# EasyEDA schematic 3 Antenna Mini-Whip (SMD)_ Main module.json
TITLE: Antenna Mini-Whip (SMD): Main module; REV: 1.3.EE; Date: 2018-03-02; Sheet: 1/1; Drawn By: IgrikXD
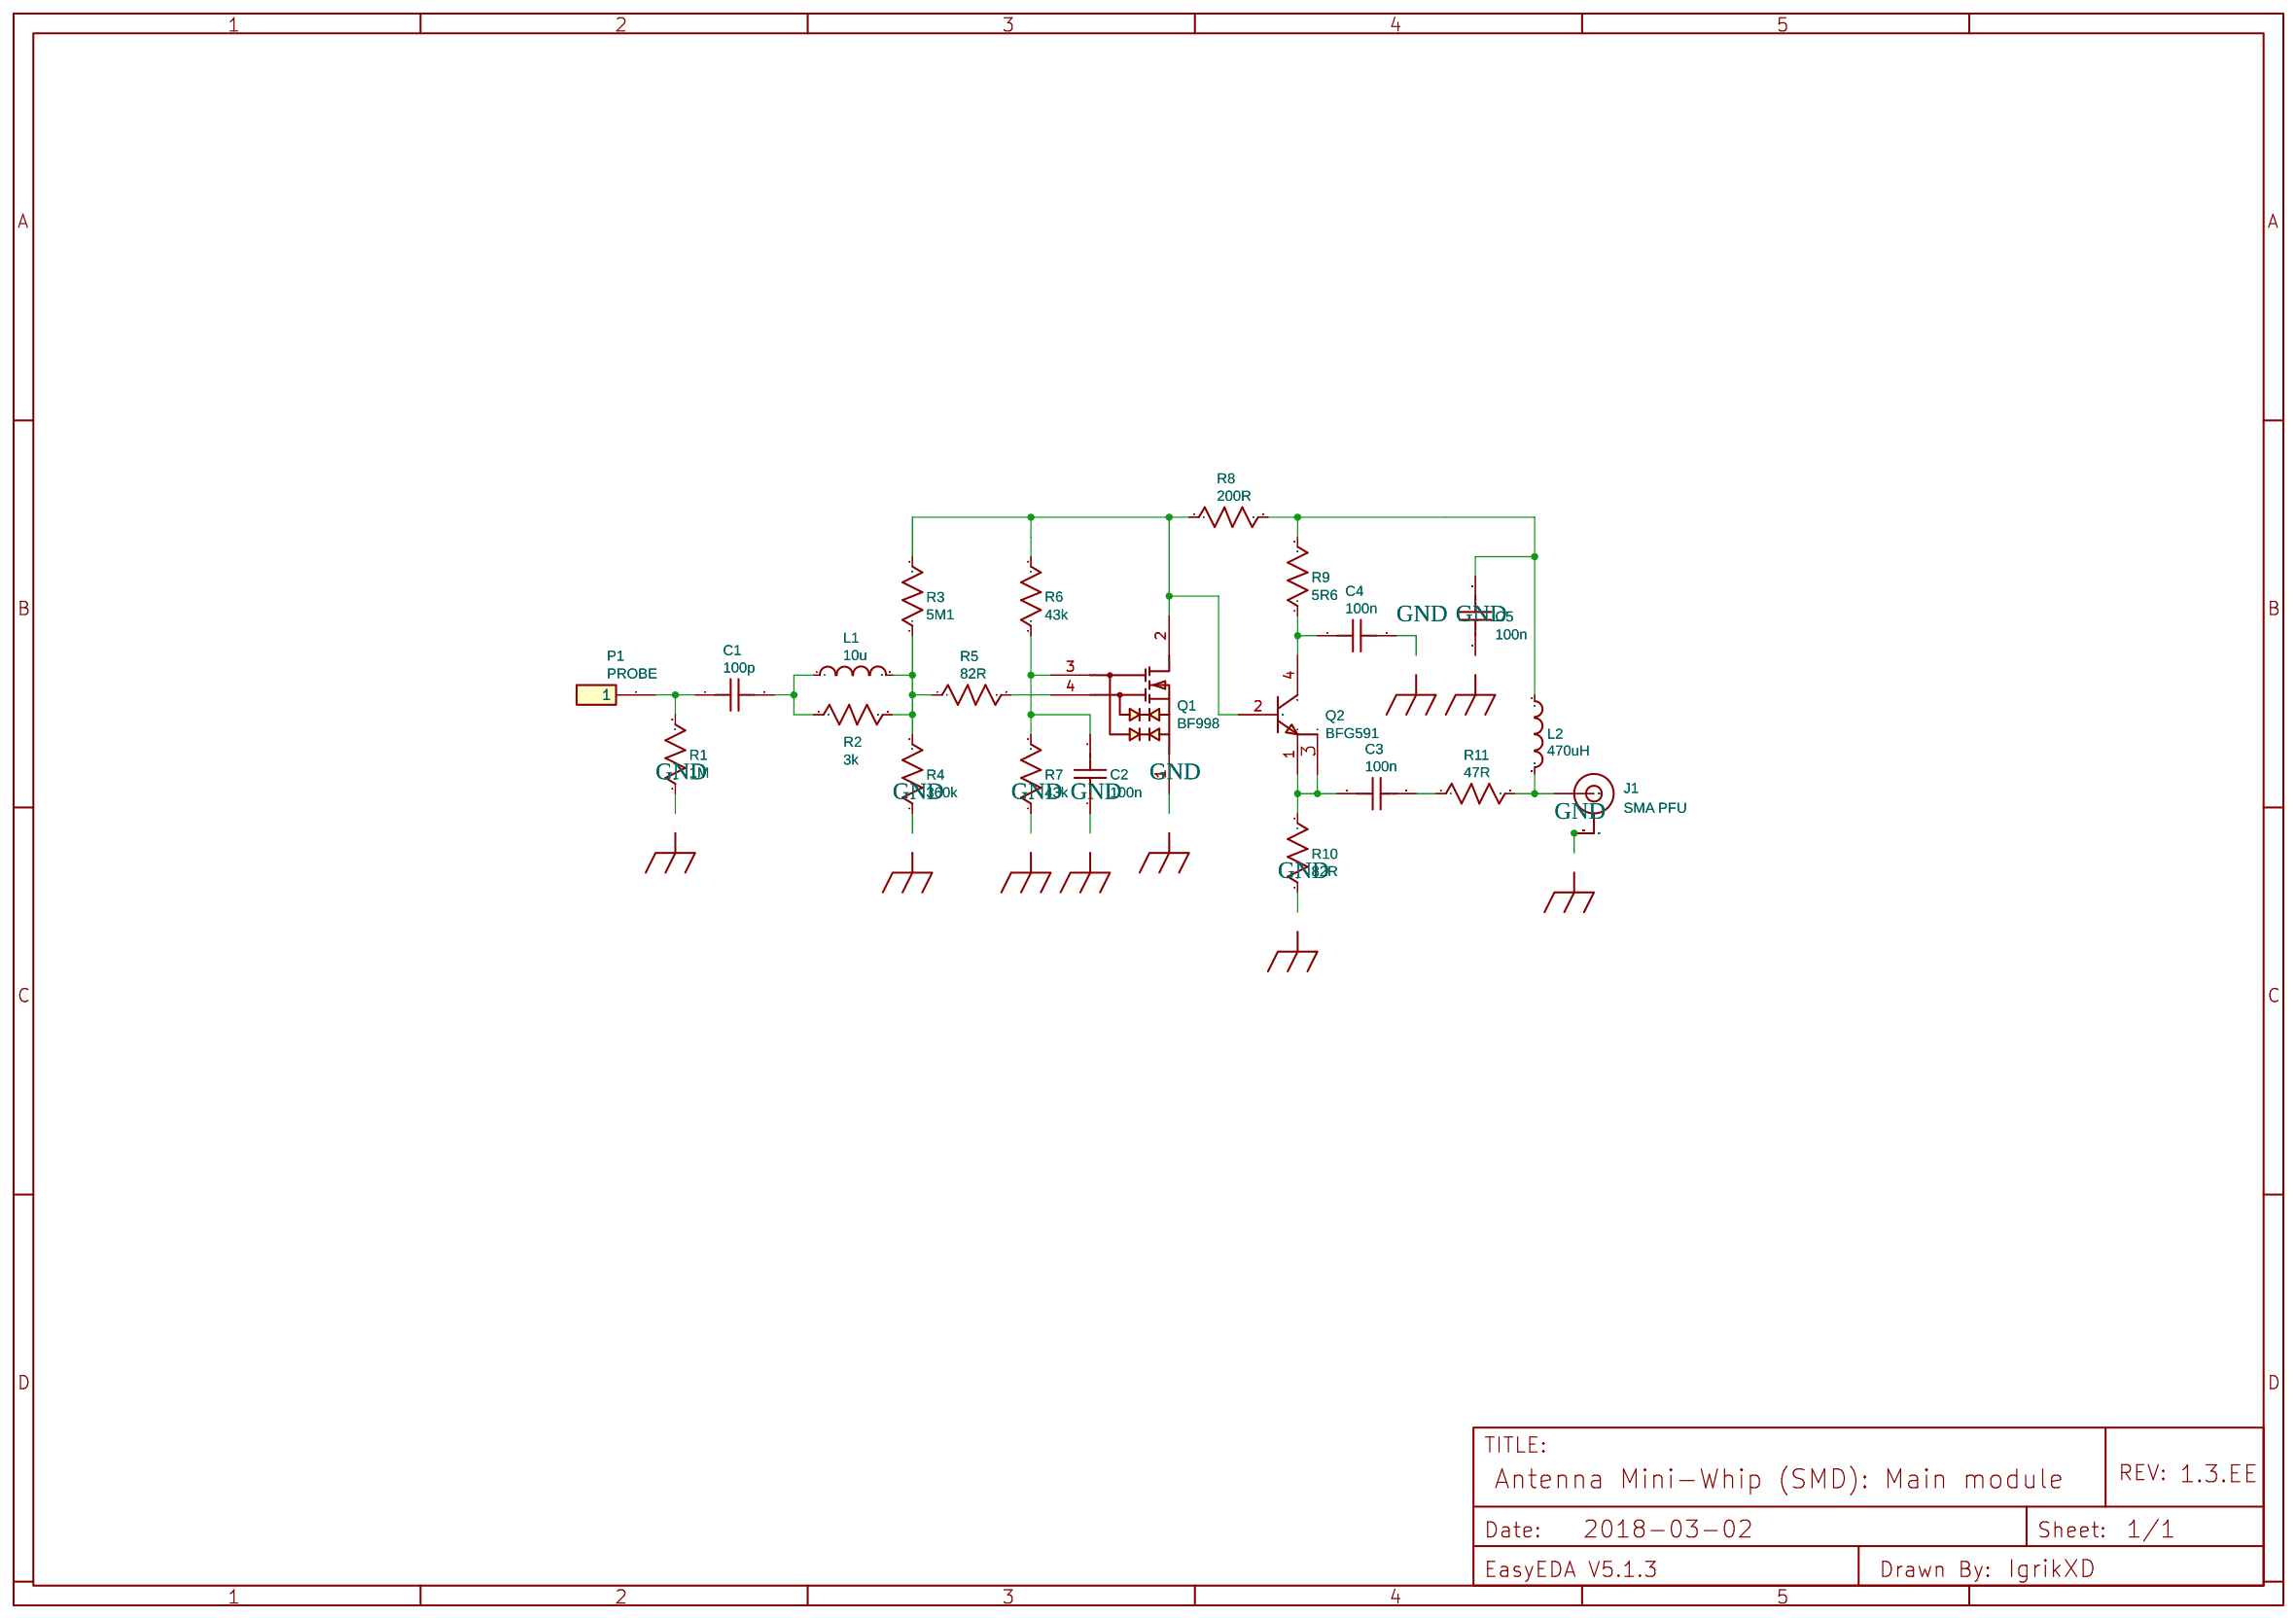
[diagram p0: schematic sheet]

## Parts
C1  100p  [0805]
C2  100n  [0805]
C3  100n  [0805]
C4  100n  [0805]
C5  100n  [0805]
J1  SMA PFU  [SMA-EDGE]
L1  10u  [0805]
L2  470uH  [7850]
P1  PROBE  [HDR-1X1/2.54]
Q1  BF998  [SOT143]
Q2  BFG591  [SOT-223]
R1  1M  [0805]
R2  3k  [0805]
R3  5M1  [0805]
R4  360k  [0805]
R5  82R  [0805]
R6  43k  [0805]
R7  43k  [0805]
R8  200R  [0805]
R9  5R6  [0805]
R10  82R  [0805]
R11  47R  [0805]

## Library data of the parts
C1 = Capacitor: Manufacturer Part: CC0805JRNPOBBN101; Supplier: LCSC; LCSC: C107122; Manufacturer: YAGEO
C2-C5 = Capacitor: Manufacturer Part: 08055C104JAT2A; Supplier: LCSC; LCSC: C129175; Manufacturer: AVX
J1 = -: SMA Antenna Connector; catid: 20; Contributor: Pinoccio; Manufacturer Part: CON-SMA-EDGE-S; Supplier: Digi-Key; Digi-Key: CON-SMA-EDGE-S-ND; Manufacturer: RF Solutions
L1 = Inductor: Manufacturer Part: MLF2012E100JT000; Supplier: LCSC; LCSC: C76742; Manufacturer: TDK
L2 = -: Supplier: LCSC; Manufacturer: SXN; Manufacturer Part: SM7850-471MT; LCSC: C10158
P1 = -: LCSC: C81276; Supplier: LCSC; Manufacturer: LCSC; Manufacturer Part: Header-Male-2.54_1x1; Mounted: No
Q1 = -: Silicon N-channel Dual-gate MOSFET; catid: 20; Manufacturer Part: BF998E6327HTSA1; Supplier: LCSC; LCSC: C108141; Manufacturer: Infineon
Q2 = -: catid: 20; Manufacturer Part: BFG591,115; Supplier: Digi-Key; Digi-Key: 568-1985-2-ND; Manufacturer: NXP USA Inc.
R1 = Resistor: Manufacturer Part: RC0805FR-071ML; Supplier: LCSC; LCSC: C107700; Manufacturer: YAGEO
R2 = Resistor: Manufacturer Part: RC0805FR-073KL; Supplier: LCSC; LCSC: C126350; Manufacturer: YAGEO
R3 = Resistor: Manufacturer Part: RC0805FR-075M1L; Supplier: LCSC; LCSC: C137506; Manufacturer: YAGEO
R4 = Resistor: Manufacturer Part: RC0805FR-07360KL; Supplier: LCSC; LCSC: C137539; Manufacturer: YAGEO
R5 R10 = Resistor: Manufacturer Part: RTT0582R0FTP; Supplier: LCSC; LCSC: C104532; Manufacturer: RALEC
R6 R7 = Resistor: Manufacturer Part: RTT054302FTP; Supplier: LCSC; LCSC: C104317; Manufacturer: RALEC
R8 = Resistor: Manufacturer Part: RTT052000FTP; Supplier: LCSC; LCSC: C104079; Manufacturer: RALEC
R9 = Resistor: Manufacturer Part: CR0805F85R60G; Supplier: LCSC; LCSC: C101807; Manufacturer: LIZ
R11 = Resistor: Manufacturer Part: RTT0547R0FTP; Supplier: LCSC; LCSC: C104358; Manufacturer: RALEC

## Nets
GND: C2.1 C4.2 C5.1 J1.GND@0(GND) J1.GND@1(GND) J1.GND@2(GND) J1.GND@3(GND) Q1.1(S) R1.1 R4.1 R7.1 R10.1
C1_2: C1.2 L1.1 R2.1
C3_2: C3.2 R11.1
J1_SIG: J1.SIG(SIGNAL) L2.2 R11.2
L1_2: L1.2 R2.2 R3.1 R4.2 R5.1
Net-(C1-1): C1.1 P1.1 R1.2
R3_2: Q1.2(D) Q2.2(B) R3.2 R6.2 R8.1
R5_2: Q1.4(G1) R5.2
R6_1: C2.2 Q1.3(G2) R6.1 R7.2
R8_2: C5.2 L2.1 R8.2 R9.2
R9_1: C4.1 Q2.4(C) R9.1
R10_2: C3.1 Q2.1(E) Q2.3(E) R10.2
